# Altium schematic sheet Modul.SchDoc
size A4
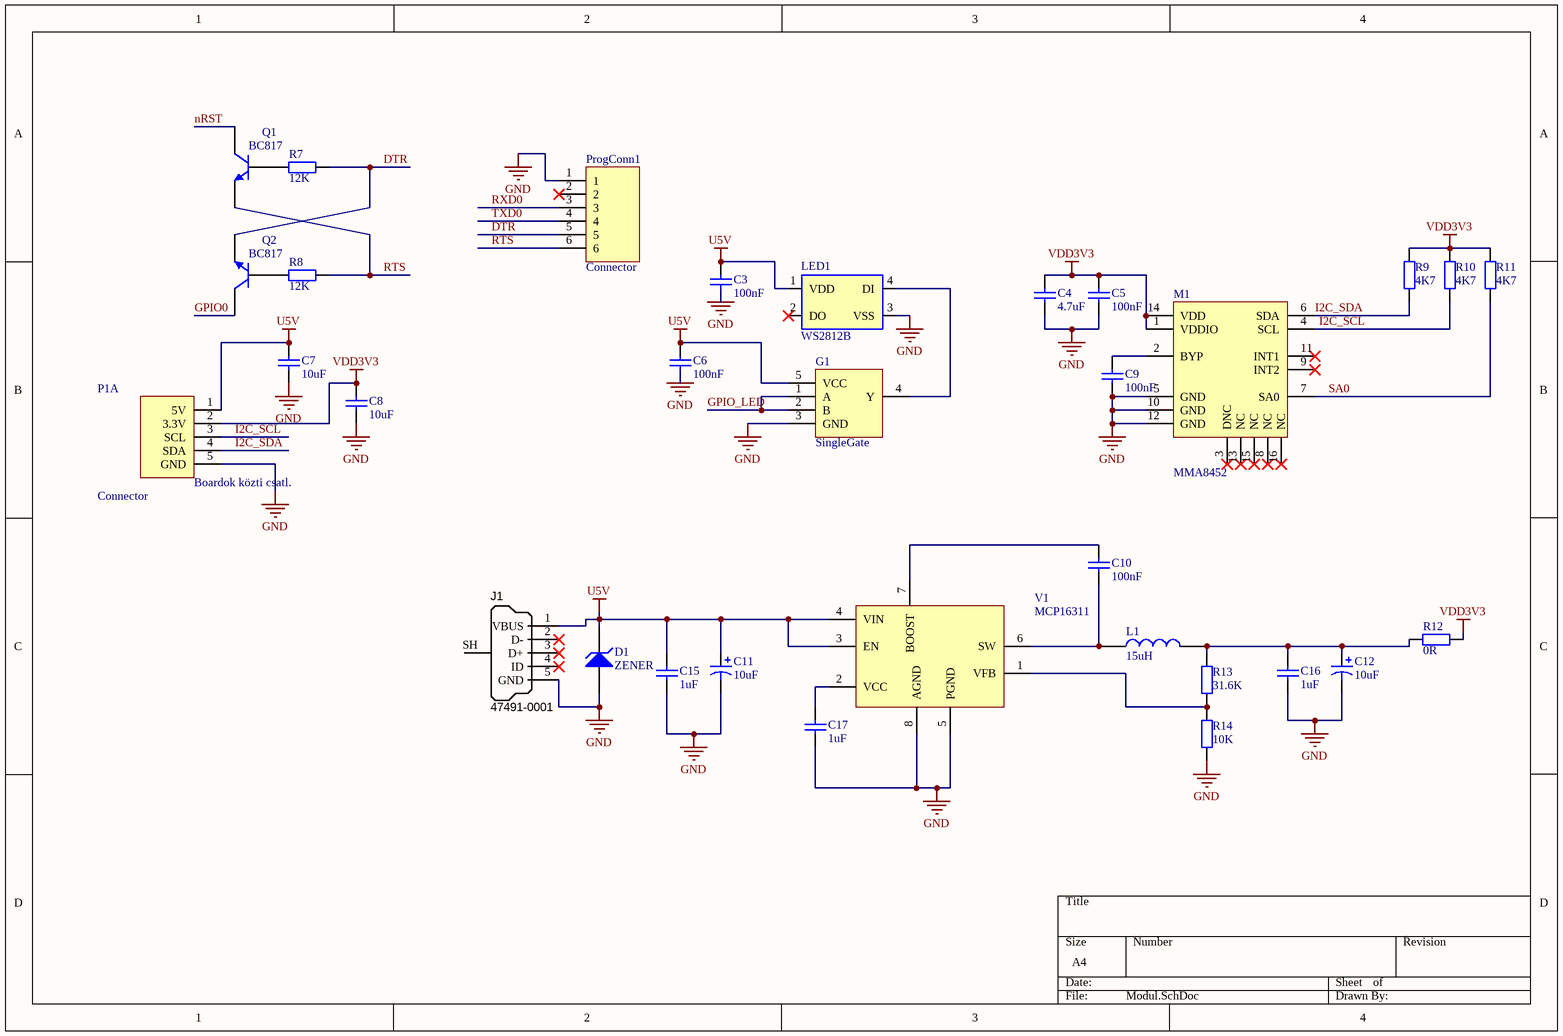
[diagram p0: Modul.SchDoc]

## Parts
C3  100nF  [FP_0805_CAP_085]
C4  4.7uF  [FP_0805_CAP_085]
C5  100nF  [FP_0805_CAP_085]
C6  100nF  [FP_0805_CAP_085]
C7  10uF  [FP_0805_CAP_085]
C8  10uF  [FP_0805_CAP_085]
C9  100nF  [FP_0805_CAP_085]
C10  100nF  [FP_0805_CAP_085]
C11  10uF  [FP_3528]
C12  10uF  [FP_3528]
C15  1uF  [FP_0805_CAP_085]
C16  1uF  [FP_0805_CAP_085]
C17  1uF  [FP_0805_CAP_085]
D1  ZENER  [FP_SMA]
G1  SingleGate  [SOT23-5]
J1  Manufacturer Part Number 1: 47491-0001  [usb_micro]  (hidden comment: USB Micro Type B)
L1  15uH  [FP_IND_MURATA3131]
LED1  WS2812B  [PLCC4-LED]
M1  MMA8452  [QFN50P300X300X100-16N]
P1  Connector  [Csatlakozok]  (part A of 3)
ProgConn1  Connector  [HEADER6b]
Q1  BC817  [FP_SOT23-3]
Q2  BC817  [FP_SOT23-3]
R7  12K  [FP_0805_RES]
R8  12K  [FP_0805_RES]
R9  4K7  [FP_0805_RES]
R10  4K7  [FP_0805_RES]
R11  4K7  [FP_0805_RES]
R12  0R  [FP_0805_RES]
R13  31.6K  [FP_0805_RES]
R14  10K  [FP_0805_RES]
V1  MCP16311  [MSOP8_TSOP65P640X120-8M]

## Nets
GND: C3.1 C4.1 C5.1 C6.1 C7.1 C8.1 C9.1 C11.N C12.N C15.1 C16.1 C17.1 D1.1(A) G1.3(GND) J1.5(GND) LED1.3(VSS) M1.5(GND) M1.10(GND) M1.12(GND) P1.5(GND) ProgConn1.1 R14.1 V1.5(PGND) V1.8(AGND)
U5V: C3.2 C6.2 C7.2 C11.P C15.2 D1.2(K) G1.5(VCC) J1.1(VBUS) LED1.1(VDD) P1.1(5V) V1.3(EN) V1.4(VIN)
VDD3V3: C4.2 C5.2 C8.2 M1.1(VDDIO) M1.14(VDD) P1.2(3.3V) R9.2 R10.2 R11.2 R12.2
DTR: ProgConn1.5 Q2.1(E) R7.2
GPIO0: Q2.3(C)
GPIO_LED: G1.1(A) G1.2(B)
I2C_SCL: M1.4(SCL) P1.3(SCL) R10.1
I2C_SDA: M1.6(SDA) P1.4(SDA) R9.1
nRST: Q1.3(C)
RTS: ProgConn1.6 Q1.1(E) R8.2
RXD0: ProgConn1.3
SA0: M1.7(SA0) R11.1
TXD0: ProgConn1.4
NetC9_2: C9.2 M1.2(BYP)
NetC10_1: C10.1 L1.1 V1.6(SW)
NetC10_2: C10.2 V1.7(BOOST)
NetC12_P: C12.P C16.2 L1.2 R12.1 R13.2
NetC17_2: C17.2 V1.2(VCC)
NetG1_4: G1.4(Y) LED1.4(DI)
NetQ1_2: Q1.2(B) R7.1
NetQ2_2: Q2.2(B) R8.1
NetR13_1: R13.1 R14.2 V1.1(VFB)

Not connected (* = marked no-connect by the designer): J1 2(D-)* 3(D+)* 4(ID)* SH(Shell); LED1 2(DO)*; M1 3(DNC)* 8(NC)* 9(INT2)* 11(INT1)* 13(NC)* 15(NC)* 16(NC)*; ProgConn1 2*

## Notes on the sheet
- (in symbol Csatlakozók, part A) Boardok közti csatl.

## Library data of the parts
C3 C5 C6 C9 C10 = CAP 100nF: Capacitor; Tolerance: +80%/-20%; Voltage: 25V; Reference: 1759167; Name: SMD Multilayer Ceramic Capacitor, 0805; Supplier: Farnell; Value: 100nF
C4 = CAP 47uF: Capacitor; Tolerance: 10%; Voltage: 10V; Reference: 9402160; Name: SMD Multilayer Ceramic Capacitor, 0805; Supplier: Farnell; Value: 4.7uF
C7 C8 = CAP 10uF: Capacitor; Tolerance: 10%; Voltage: 16V; Reference: 2320856; Name: SMD Multilayer Ceramic Capacitor, 0805; Supplier: Farnell; Value: 10uF
C11 C12 = CAP_ELECT: Polarized Capacitor; Value: 10uF
C15-C17 = CAP 1uF: Capacitor; Tolerance: +80%/-20%; Voltage: 25V; Reference: 1828853; Name: SMD Multilayer Ceramic Capacitor, 0805; Supplier: Farnell; Value: 1uF
D1 = ZENER: Zener Diode; U_Z: 24
J1 = USB_Micro_TypeB: Connector SMD USB Micro Type B middle mount; Manufacturer 1: Molex Inc; SCDType: undef; Package / Case: SMD; Supplier 1: Digi-Key; Supplier Part Number 1: WM17142CT-ND
L1 = IND: Inductor; Value: 15uH
LED1 = WS2812B: WorldSemi WS2812B Smart RGB LED; 9.UnitCost: 0.15; 1.Manufacturer: WorldSemi; 2.MfgNo: WS2812B; 3.Supplier: WorldSemi; 4.CatNo: WS2812B
P1 = Csatlakozók: A modul szélső csatlakozói (I2C,táp,programozó,UART)
ProgConn1 = Connector_6pin: 6pin connector
Q1 Q2 = BC817: NPN Transistor; pin to pad: 1>2 2>1; Reference: 1081224; Name: BC817-25,215  Bipolar (BJT) Single Transistor, General Purpose, NPN, 45 V, 100 MHz; Supplier: Farnell
R7 R8 = RES 12K: Resistor; Tolerance: 5%; Power: 125mW; Name: YAGEO (PHYCOMP)  RC0805JR-0712KL  SMD Chip Resistor, Thick Film, 12 kohm; Reference: 9234144; Supplier: Farnell; Value: 12K
R9-R11 = RES 4K7: Resistor; Tolerance: 5%; Power: 125mW; Name: YAGEO (PHYCOMP)  RC0805JR-074K7L  SMD Chip Resistor, Thick Film, 4.7 kohm; Reference: 9234098; Supplier: Farnell; Value: 4K7
R12 = RES: Resistor; Value: 0R
R13 = RES 27K: Resistor; Tolerance: 1%; Power: 125mW; Name: WALSIN  WR08X3162FTL  SMD Chip Resistor, Thick Film, 28 kohm; Reference: 2671010; Supplier: Farnell; Value: 31.6K
R14 = RES 10K: Resistor; Tolerance: 5%; Power: 125mW; Name: YAGEO (PHYCOMP)  RC0805JR-0710KL  SMD Chip Resistor, Thick Film, 10 kohm; Reference: 9234136; Supplier: Farnell; Value: 10K
M1 = MMA8452: Farnell: 1842360